# EAGLE design akabeacon_circle_MDBT40_type2 (EAGLE 7.4.0)
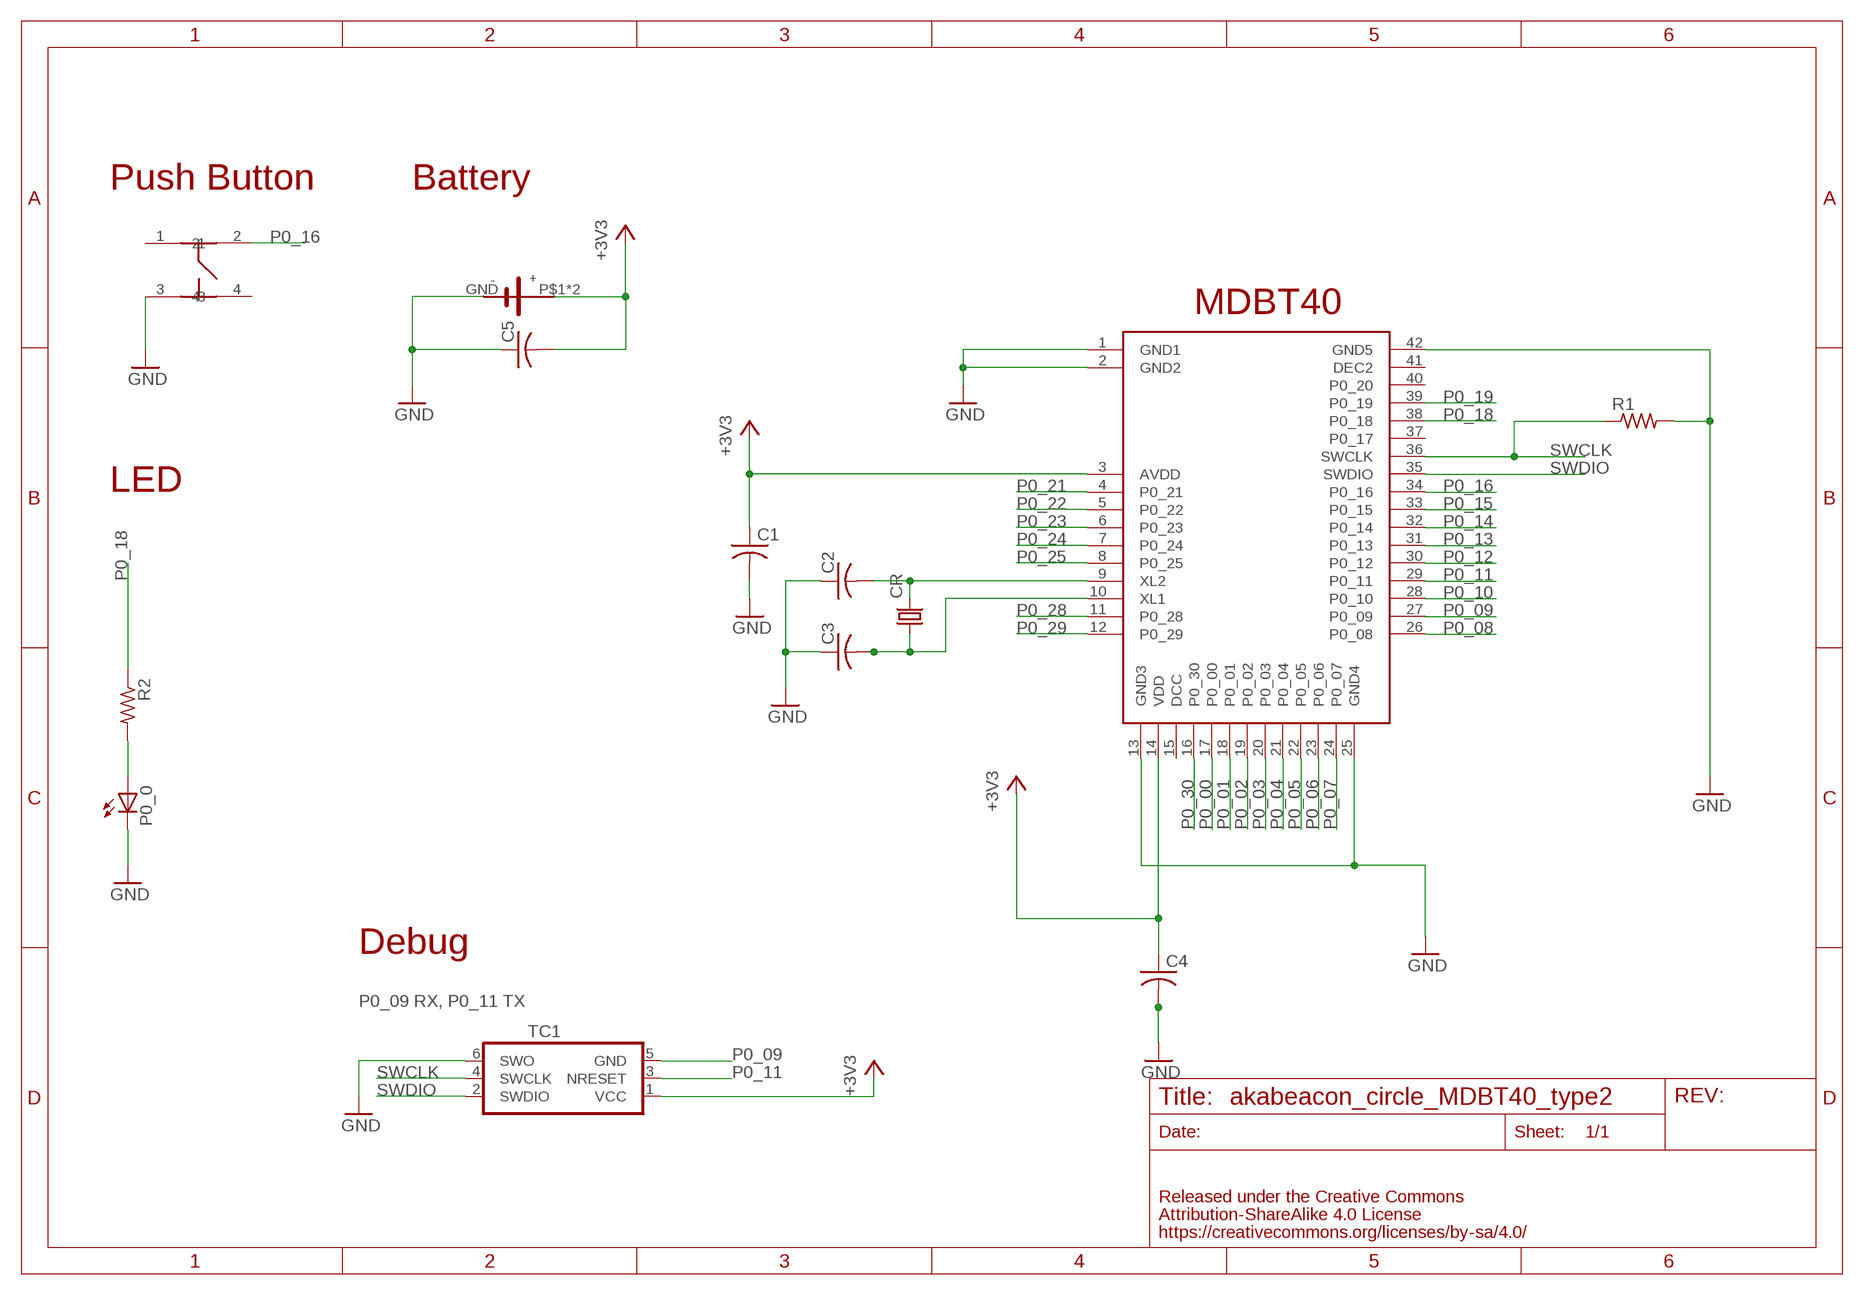
[diagram p0: schematic, sheet 1]

## Parts
C1  C-USC0603  [C0603]
C2  C-USC0603  [C0603]
C3  C-USC0603  [C0603]
C4  C-USC0603  [C0603]
C5  C-USC0603  [C0603]
CR  FC-12M  [FC-12M]
P0_0  LEDCHIP-LED0603  [CHIP-LED0603]
R1  R-US_R0603  [R0603]
R2  R-US_R0603  [R0603]
TC1  TC2030-IDC-NL  [TC2030-IDC-NL]
U$1  RAYTAC-MDBT40  [RAYTAC-MDBT40]
U$3  CIRCLE-TYPE2  [CIRCLE-TYPE2-TC2030]
U$5  SWICTH-4P(KMR2)  [SWITCH-4P(KMR2)]

## Nets
+3V3: C1.1 C4.1 C5.2 TC1.1(VCC) U$1.3(AVDD) U$1.14(VDD) U$3.P$1(VCC) U$3.P$2(VCC)
GND: C1.2 C2.1 C3.1 C4.2 C5.1 P0_0.C R1.2 TC1.6(SWO) U$1.1(GND1) U$1.2(GND2) U$1.13(GND3) U$1.25(GND4) U$1.42(GND5) U$3.GND U$5.3
N$1: P0_0.A R2.2
N$7: C2.2 CR.2 U$1.9(XL2)
N$8: C3.2 CR.1 U$1.10(XL1)
P0_00: U$1.17(P0_00)
P0_01: U$1.18(P0_01)
P0_02: U$1.19(P0_02)
P0_03: U$1.20(P0_03)
P0_04: U$1.21(P0_04)
P0_05: U$1.22(P0_05)
P0_06: U$1.23(P0_06)
P0_07: U$1.24(P0_07)
P0_08: U$1.26(P0_08)
P0_09: TC1.5(GND) U$1.27(P0_09)
P0_10: U$1.28(P0_10)
P0_11: TC1.3(NRESET) U$1.29(P0_11)
P0_12: U$1.30(P0_12)
P0_13: U$1.31(P0_13)
P0_14: U$1.32(P0_14)
P0_15: U$1.33(P0_15)
P0_16: U$1.34(P0_16) U$5.2
P0_18: R2.1 U$1.38(P0_18)
P0_19: U$1.39(P0_19)
P0_21: U$1.4(P0_21)
P0_22: U$1.5(P0_22)
P0_23: U$1.6(P0_23)
P0_24: U$1.7(P0_24)
P0_25: U$1.8(P0_25)
P0_28: U$1.11(P0_28)
P0_29: U$1.12(P0_29)
P0_30: U$1.16(P0_30)
SWCLK: R1.1 TC1.4(SWCLK) U$1.36(SWCLK)
SWDIO: TC1.2(SWDIO) U$1.35(SWDIO)
Unconnected: U$1.15(DCC) U$1.37(P0_17) U$1.40(P0_20) U$1.41(DEC2) U$5.1 U$5.4

## Notes on the sheet
- Push Button | Battery
- MDBT40
- LED
- Debug
- P0_09 RX, P0_11 TX

## Library data of the parts
C1-C5 = adafruit:C-US: CAPACITOR, American symbol
CR = crystal:FC-12M: kHz RANGE CRYSTAL UNIT LOW PROFILE SMD Source: Epson Toyocom FC-12M.pdf
P0_0 = led:LED: LED OSRAM: - CHIPLED LG R971, LG N971, LY N971, LG Q971, LY Q971, LO R971, LY R971 LH N974, LH R974 LS Q976, LO Q976, LY Q976 LO Q996 - Hyper CHIPLED LW Q18S LB Q993, LB Q99A, LB R99A - SideLED LS A670, LO A670, LY A670, LG A670, LP A670 LB A673, LV A673, LT A673, LW A673 LH A674 LY A675 LS A676, LA A676, LO A676, LY A676, LW A676 LS A679, LY A679, LG A679 - Hyper Micro SIDELED® LS Y876, LA Y876, LO Y876, LY Y876 LT Y87S - SmartLED LW L88C, LW L88S LB L89C, LB L89S, LG L890 LS L89K, LO L89K, LY L89K LS L896, LA L896, LO L896, LY L896 - TOPLED LS T670, LO T670, LY T670, LG T670, LP T670 LSG T670, LSP T670, LSY T670, LOP T670, LYG T670 LG T671, LOG T671, LSG T671 LB T673, LV T673, LT T673, LW T673 LH T674 LS T676, LA T676, LO T676, LY T676, LB T676, LH T676, LSB T676, LW T676 LB T67C, LV T67C, LT T67C, LS T67K, LO T67K, LY T67K, LW E67C LS E67B, LA E67B, LO E67B, LY E67B, LB E67C, LV E67C, LT E67C LW T67C LS T679, LY T679, LG T679 LS T770, LO T770, LY T770, LG T770, LP T770 LB T773, LV T773, LT T773, LW T773 LH T774 LS E675, LA E675, LY E675, LS T675 LS T776, LA T776, LO T776, LY T776, LB T776 LHGB T686 LT T68C, LB T68C - Hyper Mini TOPLED® LB M676 - Mini TOPLED Santana® LG M470 LS M47K, LO M47K, LY M47K Source: http://www.osram.convergy.de LUXEON: - LUMILED® LXK2-PW12-R00, LXK2-PW12-S00, LXK2-PW14-U00, LXK2-PW14-V00 LXK2-PM12-R00, LXK2-PM12-S00, LXK2-PM14-U00 LXK2-PE12-Q00, LXK2-PE12-R00, LXK2-PE12-S00, LXK2-PE14-T00, LXK2-PE14-U00 LXK2-PB12-K00, LXK2-PB12-L00, LXK2-PB12-M00, LXK2-PB14-N00, LXK2-PB14-P00, LXK2-PB14-Q00 LXK2-PR12-L00, LXK2-PR12-M00, LXK2-PR14-Q00, LXK2-PR14-R00 LXK2-PD12-Q00, LXK2-PD12-R00, LXK2-PD12-S00 LXK2-PH12-R00, LXK2-PH12-S00 LXK2-PL12-P00, LXK2-PL12-Q00, LXK2-PL12-R00 Source: www.luxeon.com KINGBRIGHT: KA-3528ASYC Source: www.kingbright.com
R1 R2 = adafruit:R-US_: RESISTOR, American symbol
TC1 = TagConnect:TC2030-IDC: Tag-Connect In Circuit Programming & Debug Cable 6 Pin http://www.tag-connect.com
U$1 = FaBo-BT:RAYTAC-MDBT40
U$3 = FaBo-Template:CIRCLE-TYPE2
U$5 = gclue-test:SWICTH-4P(KMR2)

## Board
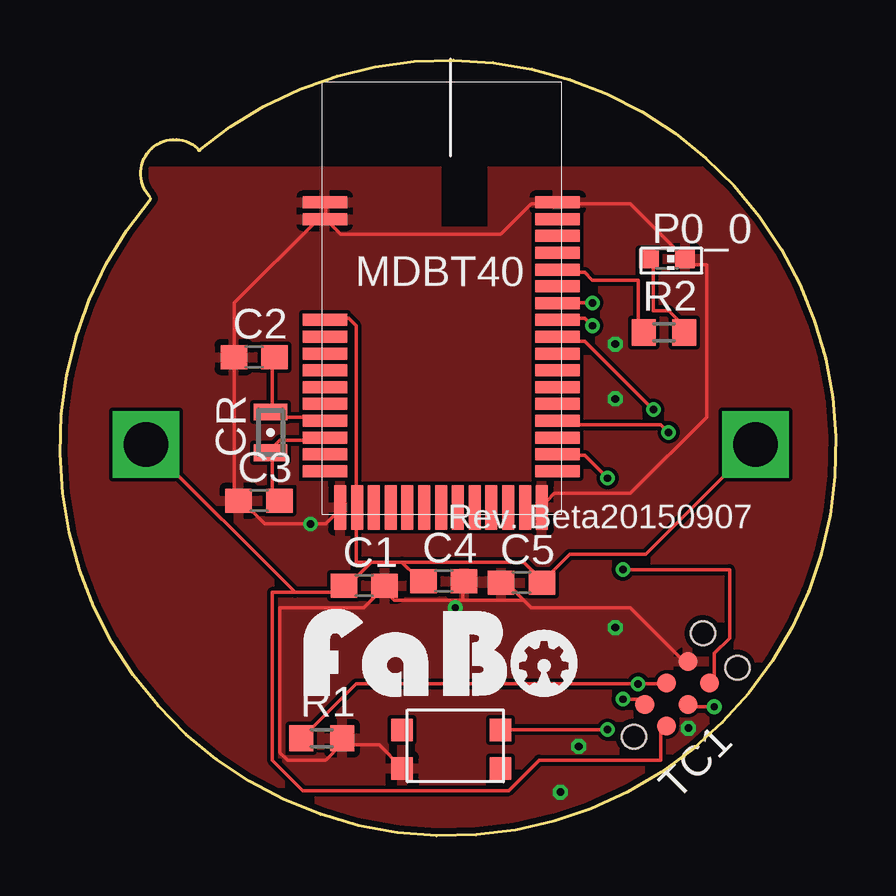
[diagram p1: board, top side]
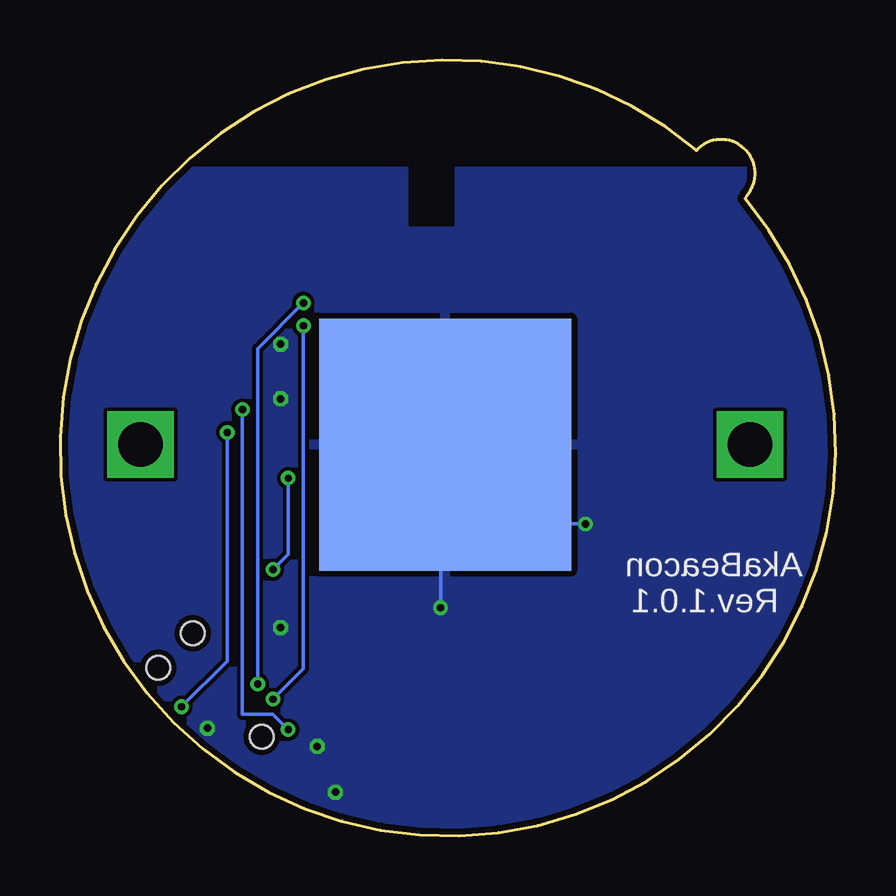
[diagram p2: board, bottom side, seen from below]

Size 32.32 x 32.32 mm. Coordinates in mm from the lower left corner, seen from the top.
Copper layers (1*16): Top 0.035mm / dielectric 1.5mm / Bottom 0.035mm
Design rules "SeeedStudio_2layer_DRU_no_angle_20140221": minimum track width 6mil, minimum drill 12mil, track to track 6mil, track to pad 6mil, pad to pad 6mil, via to via 6mil, smd to smd 0mil, copper to edge 10mil, drill to drill 10mil, minimum pad ring 10mil, minimum via ring 6mil, stop-mask expansion 2mil, vias tented up to drill 100mil, thermal gap 10mil

### Footprints (pad centres in the part's own frame; a part is rotated, then mirrored left to right if it is on the bottom)
C0603 = smd 1.1 x 1: 1 -0.85,0; 2 0.85,0
FC-12M = smd 0.7 x 1.4: 1 -0.85,0; 2 0.85,0
CHIP-LED0603 = smd 0.8 x 0.8: A 0,-0.75; C 0,0.75
R0603 = smd 1 x 1.1: 1 -0.85,0; 2 0.85,0
TC2030-IDC-NL = smd 0.787 x 0.787: 1 -1.27,-0.635; 2 -1.27,0.635; 3 0,-0.635; 4 0,0.635; 5 1.27,-0.635; 6 1.27,0.635 | hole 0.991: -2.54,0; 2.54,1.016; 2.54,-1.016
RAYTAC-MDBT40 = smd 1.85 x 0.5: 1 -4.86,4; 2 -4.86,3.3; 3 -4.86,-0.9; 4 -4.86,-1.6; 5 -4.86,-2.3; 6 -4.86,-3; 7 -4.86,-3.7; 8 -4.86,-4.4; 9 -4.86,-5.1; 10 -4.86,-5.8; 11 -4.86,-6.5; 12 -4.86,-7.2; 26 4.84,-7.2; 27 4.84,-6.5; 28 4.84,-5.8; 29 4.84,-5.1; 30 4.84,-4.4; 31 4.84,-3.7; 32 4.84,-3; 33 4.84,-2.3; 34 4.84,-1.6; 35 4.84,-0.9; 36 4.84,-0.2; 37 4.84,0.5; 38 4.84,1.2; 39 4.84,1.9; 40 4.84,2.6; 41 4.84,3.3; 42 4.84,4 | smd 0.5 x 1.85: 13 -4.22,-8.71; 14 -3.52,-8.71; 15 -2.82,-8.71; 16 -2.12,-8.71; 17 -1.42,-8.71; 18 -0.72,-8.71; 19 -0.02,-8.71; 20 0.68,-8.71; 21 1.38,-8.71; 22 2.08,-8.71; 23 2.78,-8.71; 24 3.48,-8.71; 25 4.18,-8.71
CIRCLE-TYPE2-TC2030 = smd 10.5 x 10.5 bottom: GND 0,0 | drill 1.85 square: P$1 -12.7,0; P$2 12.7,0
SWITCH-4P(KMR2) = smd 0.9 x 0.95: 1 -1,0; 2 3.1,0; 3 -1,-1.6; 4 3.1,-1.6

### Placement (x,y rotation side)
C1  12.68,10.42 0 top
C2  8.09,19.94 0 top
C3  8.3,13.97 0 top
C4  15.99,10.61 0 top
C5  19.23,10.54 0 top
CR  8.77,16.81 90 top
P0_0  25.29,24.04 270 top
R1  10.9,4.07 0 top
R2  25.16,20.98 0 top
TC1  25.71,5.92 45 top
U$1  15.9,22.39 0 top
U$2  [LOGO_FABO_M]  15.87,5.8 0 top
U$3  16.28,16.3 0 top
U$5  15.25,4.41 0 top

### Tracks (layer width: path | path; a pad name or v marks a point on that pad's centre or on a via)
+3V3
  Top 0.152: 9.8,10.14 11.71,10.14 C1.1 12.02,10.46 12.98,11.41 | 9.8,10.14 8.85,10.14 8.85,3.15 10.12,1.88 18.69,1.88 19.96,3.15 25.04,3.15 25.04,4.42 TC1.1 | 14.25,11.41 14.88,10.77 C4.1 | 12.98,11.41 14.25,11.41 | 14.25,11.41 19.33,11.41 19.96,10.77 C5.2 20.28,10.77 21.23,11.73 24.41,11.73 U$3.P$2 | 12.98,11.41 12.34,11.41 12.34,13.63 U$1.14 12.34,13.95 12.34,21.25 12.02,21.57 11.07,21.57 U$1.3 | 9.8,10.14 3.77,16.17 U$3.P$1
GND  (via drill 0.3, 0.32)
  Top 0.152: 11.07,25.7 11.07,26.33 U$1.1 | U$1.13 11.71,13.63 11.07,13 v10.44,13 8.53,13 7.58,13.95 C3.1 7.26,14.27 7.26,19.66 C2.1 7.26,19.98 7.26,22.2 10.75,25.7 U$1.2 11.07,25.7 | U$1.25 20.28,13.95 20.6,14.27 23.77,14.27 26.95,17.44 26.95,23.79 26.31,23.79 P0_0.C 25.99,24.11 23.77,26.33 20.91,26.33 U$1.42 20.6,26.33 19.64,26.33 18.37,25.06 11.71,25.06 11.07,25.7 | U$5.3 14.25,2.84 13.29,3.79 12.02,3.79 R1.2 11.71,3.79 11.07,3.15 9.48,3.15 9.17,3.47 9.17,9.5 12.66,9.5 13.29,10.14 C1.2 13.61,10.14 13.93,9.82 16.47,9.82 | 19.33,9.82 18.69,10.46 C5.1 | 19.33,9.82 19.64,9.5 23.77,9.5 25.99,7.28 TC1.6 | 19.33,9.82 16.79,9.82 | 16.79,9.82 16.47,9.82 | 16.79,9.82 16.79,10.46 C4.2 | v16.47,9.5 16.47,9.82
  Bottom 0.152: 16.47,13 16.47,16.17 U$3.GND 16.47,13 | 16.47,13 v16.47,9.5 | 16.47,13 v10.44,13
  other vias: 23.14,20.49 23.14,18.2 21.61,3.72 20.85,1.82 23.14,8.68 26.18,4.49
  pour Bottom: -1.63,-0.85 33.8,-0.85 33.8,30.73 -1.63,30.73
  pour Top: -1.63,-0.47 33.42,-0.47 33.42,30.56 -1.63,30.56
N$1
  Top 0.152: P0_0.A 24.72,23.79 24.72,21.89 25.36,21.89 25.99,21.25 R2.2
N$7
  Top 0.152: C2.2 8.85,19.66 8.85,17.76 CR.2 8.85,17.44 10.75,17.44 U$1.9
N$8
  Top 0.152: C3.2 8.85,14.27 8.85,15.85 CR.1 8.85,16.17 9.17,16.49 10.75,16.49 U$1.10
P0_09  (via drill 0.3)
  Top 0.152: v23.45,11.09 27.9,11.09 27.9,8.23 27.26,7.6 27.26,6.65 TC1.5 | v22.82,14.9 21.87,15.85 20.91,15.85 U$1.27
  Bottom 0.152: v23.45,11.09 22.82,11.73 v22.82,14.9
P0_11  (via drill 0.3)
  Top 0.152: v27.26,5.38 26.31,5.38 TC1.3 | v25.36,16.81 25.04,17.12 20.91,17.12 U$1.29
  Bottom 0.152: v27.26,5.38 25.36,7.28 v25.36,16.81
P0_16  (via drill 0.3)
  Top 0.152: v22.82,4.42 18.37,4.42 U$5.2 | v24.72,17.76 21.87,20.62 20.91,20.62 U$1.34
  Bottom 0.152: v22.82,4.42 23.45,5.06 24.72,5.06 v24.72,17.76
P0_18
  Top 0.152: R2.1 24.09,21.25 24.09,23.16 22.18,23.16 21.87,23.47 20.91,23.47 U$1.38
SWCLK  (via drill 0.3)
  Top 0.152: TC1.4 25.04,6.33 v24.09,6.33 12.34,6.33 10.12,4.11 R1.1 | v22.18,22.2 20.91,22.2 U$1.36
  Bottom 0.152: v22.18,22.2 24.09,20.3 v24.09,6.33
SWDIO  (via drill 0.3)
  Top 0.152: v23.45,5.69 24.09,5.69 TC1.2 | v22.18,21.25 21.87,21.57 20.91,21.57 U$1.35
  Bottom 0.152: v23.45,5.69 22.18,6.96 v22.18,21.25

### Text on the board
tPlace: Rev. Beta20150907
bPlace: AkaBeacon | Rev.1.0.1